# Altium schematic sheet Nextion bridge.SchDoc
size A4
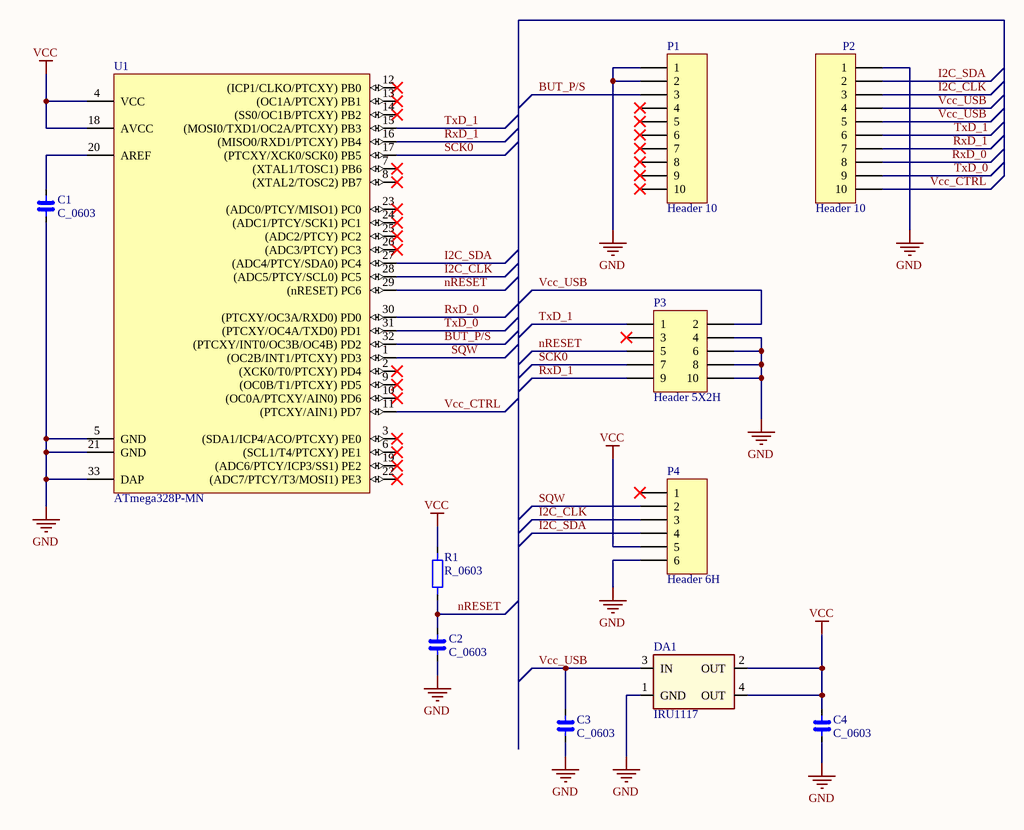
[diagram p0: Nextion bridge.SchDoc]

## Parts
C1  C_0603  [SM/C_0603]
C2  C_0603  [SM/C_0603]
C3  C_0603  [SM/C_0603]
C4  C_0603  [SM/C_0603]
DA1  IRU1117  [SOT223]
P1  Header 10  [HDR1X10]
P2  Header 10  [HDR1X10]
P3  Header 5X2H  [HDR2X5H]
P4  Header 6H  [HDR1X6H]
R1  R_0603  [SM/R_0603]
U1  ATmega328P-MN  [32M1-A_N]

## Nets
GND: C1.2 C2.2 C3.2 C4.2 DA1.1(GND) P1.1 P1.2 P2.1 P3.4 P3.6 P3.8 P3.10 P4.6 U1.5(GND) U1.21(GND) U1.33(DAP)
VCC: C4.1 DA1.2(OUT) DA1.4(OUT) P4.5 R1.2 U1.4(VCC) U1.18(AVCC)
BUT_P/S: P1.3 U1.32((PTCXY/INT0/OC3B/OC4B)_PD2)
I2C_CLK: P2.3 P4.3 U1.28((ADC5/PTCY/SCL0)_PC5)
I2C_SDA: P2.2 P4.4 U1.27((ADC4/PTCY/SDA0)_PC4)
nRESET: C2.1 P3.5 R1.1 U1.29((nRESET)_PC6)
RxD_0: P2.8 U1.30((PTCXY/OC3A/RXD0)_PD0)
RxD_1: P2.7 P3.9 U1.16((MISO0/RXD1/PTCXY)_PB4)
SCK0: P3.7 U1.17((PTCXY/XCK0/SCK0)_PB5)
SQW: P4.2 U1.1((OC2B/INT1/PTCXY)_PD3)
TxD_0: P2.9 U1.31((PTCXY/OC4A/TXD0)_PD1)
TxD_1: P2.6 P3.1 U1.15((MOSI0/TXD1/OC2A/PTCXY)_PB3)
Vcc_CTRL: P2.10 U1.11((PTCXY/AIN1)_PD7)
Vcc_USB: C3.1 DA1.3(IN) P2.4 P2.5 P3.2
NetC1_1: C1.1 U1.20(AREF)

Not connected (* = marked no-connect by the designer): P1 4* 5* 6* 7* 8* 9* 10*; P3 3*; P4 1*; U1 2((XCK0/T0/PTCXY)_PD4)* 3((SDA1/ICP4/ACO/PTCXY)_PE0)* 6((SCL1/T4/PTCXY)_PE1)* 7((XTAL1/TOSC1)_PB6)* 8((XTAL2/TOSC2)_PB7)* 9((OC0B/T1/PTCXY)_PD5)* 10((OC0A/PTCXY/AIN0)_PD6)* 12((ICP1/CLKO/PTCXY)_PB0)* 13((OC1A/PTCXY)_PB1)* 14((SS0/OC1B/PTCXY)_PB2)* 19((ADC6/PTCY/ICP3/SS1)_PE2)* 22((ADC7/PTCY/T3/MOSI1)_PE3)* 23((ADC0/PTCY/MISO1)_PC0)* 24((ADC1/PTCY/SCK1)_PC1)* 25((ADC2/PTCY)_PC2)* 26((ADC3/PTCY)_PC3)*

## Library data of the parts
C1-C4 = C_0603: Manufacturer: AVX; Type: X7R; Voltage: 50V; TCC: ±15%; Tolerance: ±20%; Package: 0603; ManufacturerPartNumber: *
DA1 = IRU1117: Тип: IRU1117-18CY; Package: SOT-223
P1 P2 = Header 10: Header, 10-Pin; LatestRevisionDate: 17-Jul-2002; LatestRevisionNote: Re-released for DXP Platform.; Publisher: Altium Limited
P3 = Header 5X2H: Header, 5-Pin, Dual row, Right Angle; LatestRevisionDate: 17-Jul-2002; LatestRevisionNote: Re-released for DXP Platform.; Publisher: Altium Limited
P4 = Header 6H: Header, 6-Pin, Right Angle; LatestRevisionDate: 17-Jul-2002; LatestRevisionNote: Re-released for DXP Platform.; Publisher: Altium Limited
R1 = R_0603: Manufacturer: YAGEO; Tolerance: ±5%; TCR: ±100ppm/°C; Power: 1/10W; Type: RC; Package: 0603; ManufacturerPartNumber: *
U1 = ATmega328P-MN: 8-bit AVR Microcontroller, 32KB Flash, 1KB EEPROM, 2KB SRAM, 32-pin MLF, Industrial Grade (-40°C to 105°C); DatasheetVersion: revD, May-2011; PackageVersion: revE, May-2006; PackageReference: 32M1-A; PackageDescription: 32-Pin Micro Lead Frame Package (MLF),  5 x 5 x 1.0 mm Body, Pitch 0.50 mm, 3.10mm Exposed Pad; Code_JEDEC: MO-220-VHHD-2; ComponentLink1Description: Manufacturer URL; ComponentLink1URL: http://www.atmel.com/; ComponentLink2Description: ATmega48A/48PA/88A/88PA/168A/168PA/328/328P Datasheet; ComponentLink2URL: http://www.atmel.com/dyn/resources/prod_documents/8271.pdf; ComponentLink3Description: ATmega48A/48PA/88A/88PA/168A/168PA/328/328P Summary; ComponentLink3URL: http://www.atmel.com/dyn/resources/prod_documents/8271S.pdf